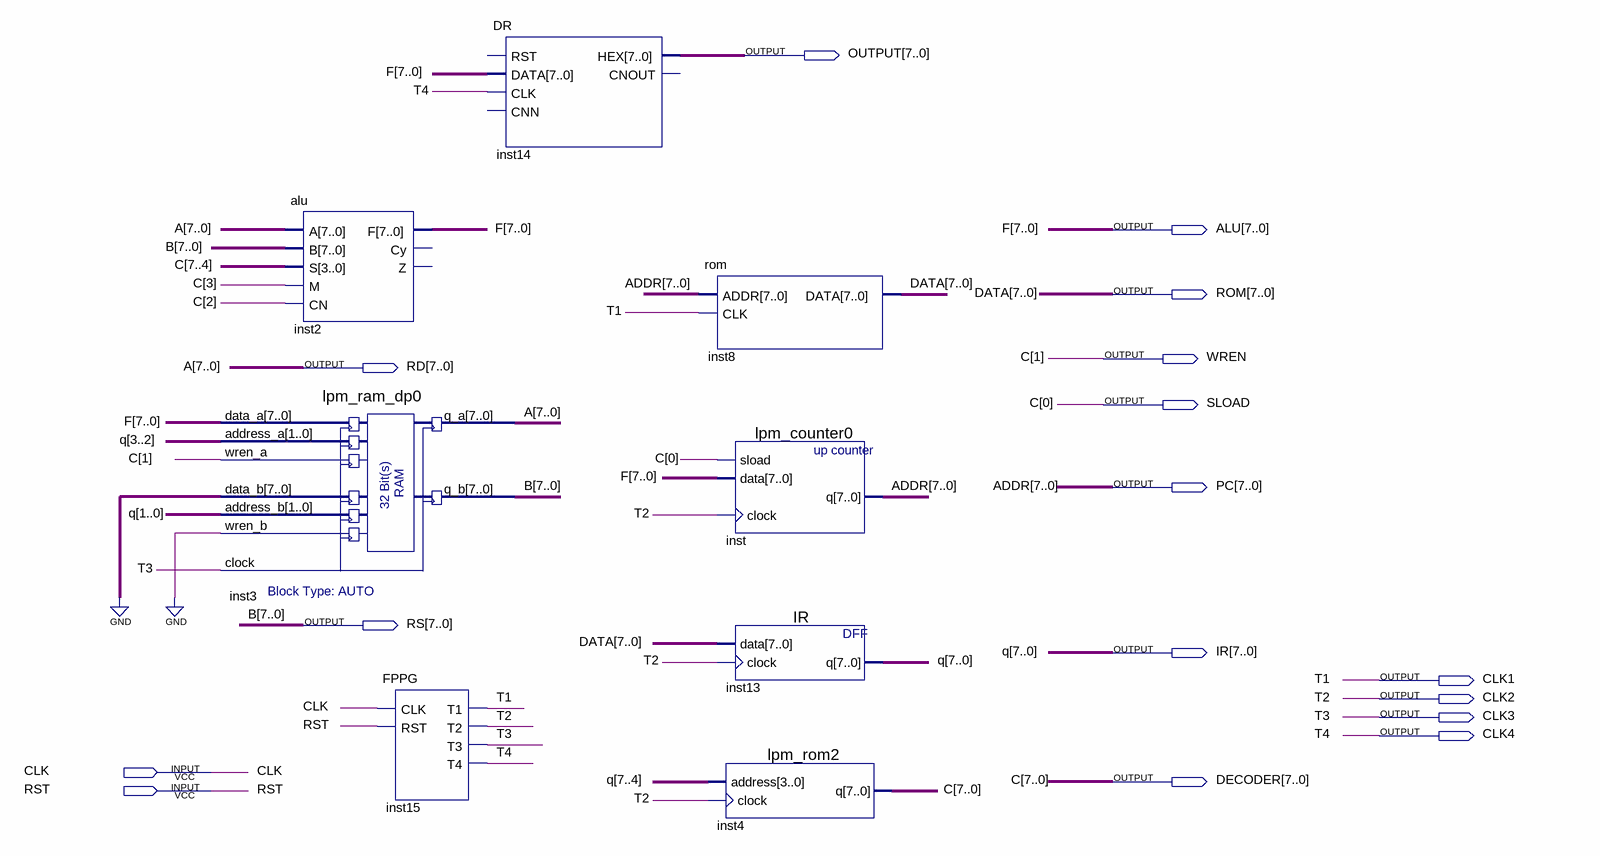
[diagram p0: schematic sheet]
// Quartus schematic cpu.bdf as structural Verilog: 8 symbols, 16 pins
module cpu (
  input  CLK,
  input  RST,
  output [7:0] OUTPUT,
  output [7:0] ALU,
  output [7:0] ROM,
  output WREN,
  output [7:0] RD,
  output SLOAD,
  output [7:0] PC,
  output [7:0] RS,
  output [7:0] IR,
  output CLK1,
  output CLK2,
  output CLK3,
  output CLK4,
  output [7:0] DECODER
);

  lpm_ram_dp0 inst3 (
    .data_a(ALU), .address_a(IR[3:2]), .wren_a(DECODER[1]), .data_b({8{1'b0}}), .address_b(IR[1:0]),
    .wren_b(1'b0), .clock(CLK3), .q_a(RD), .q_b(RS));
  alu inst2 (.A(RD), .B(RS), .S(DECODER[7:4]), .M(DECODER[3]), .CN(DECODER[2]), .F(ALU));  // open: Cy, Z
  FPPG inst15 (.CLK(CLK), .RST(RST), .T1(CLK1), .T2(CLK2), .T3(CLK3), .T4(CLK4));
  DR inst14 (.DATA(ALU), .CLK(CLK4), .HEX(OUTPUT));  // open: RST, CNN, CNOUT
  rom inst8 (.ADDR(PC), .CLK(CLK1), .DATA(ROM));
  lpm_rom2 inst4 (.address(IR[7:4]), .clock(CLK2), .q(DECODER));
  lpm_counter0 inst (.sload(DECODER[0]), .data(ALU), .clock(CLK2), .q(PC));
  IR inst13 (.data(ROM), .clock(CLK2), .q(IR));

  assign SLOAD = DECODER[0];
  assign WREN = DECODER[1];

  // Other names for the same wires on the sheet: A[7:0] = RD; ADDR[7:0] = PC; B[7:0] = RS; C[7:0] = DECODER;
  //   DATA[7:0] = ROM; F[7:0] = ALU; q[7:0] = IR; T1 = CLK1; T2 = CLK2; T3 = CLK3; T4 = CLK4
endmodule
